# Altium schematic sheet InstrumentsMesure.SchDoc
size A4; SheetNumber: 4; SheetTotal: 4
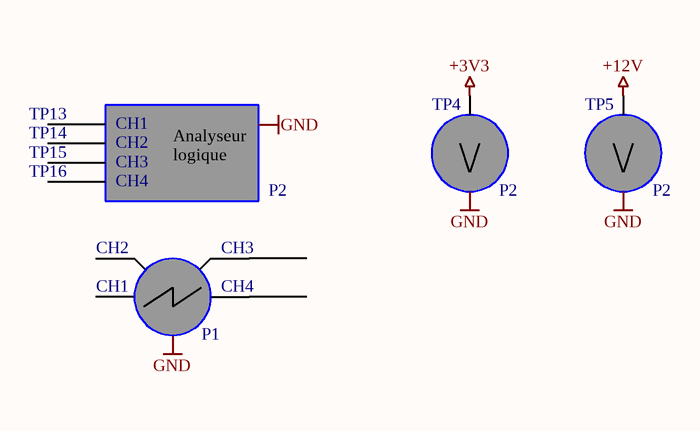
[diagram p0: InstrumentsMesure.SchDoc]

## Notes on the sheet
- TP13
- TP14
- TP15
- CH1
- CH2
- TP4
- TP5
- TP16
- CH3
- CH4
- Analyseur
  logique
- P2
- P1
- Labels drawn without touching a wire or pin: +3V3, +12V, GND